# Altium schematic sheet Overo.SchDoc
size A4
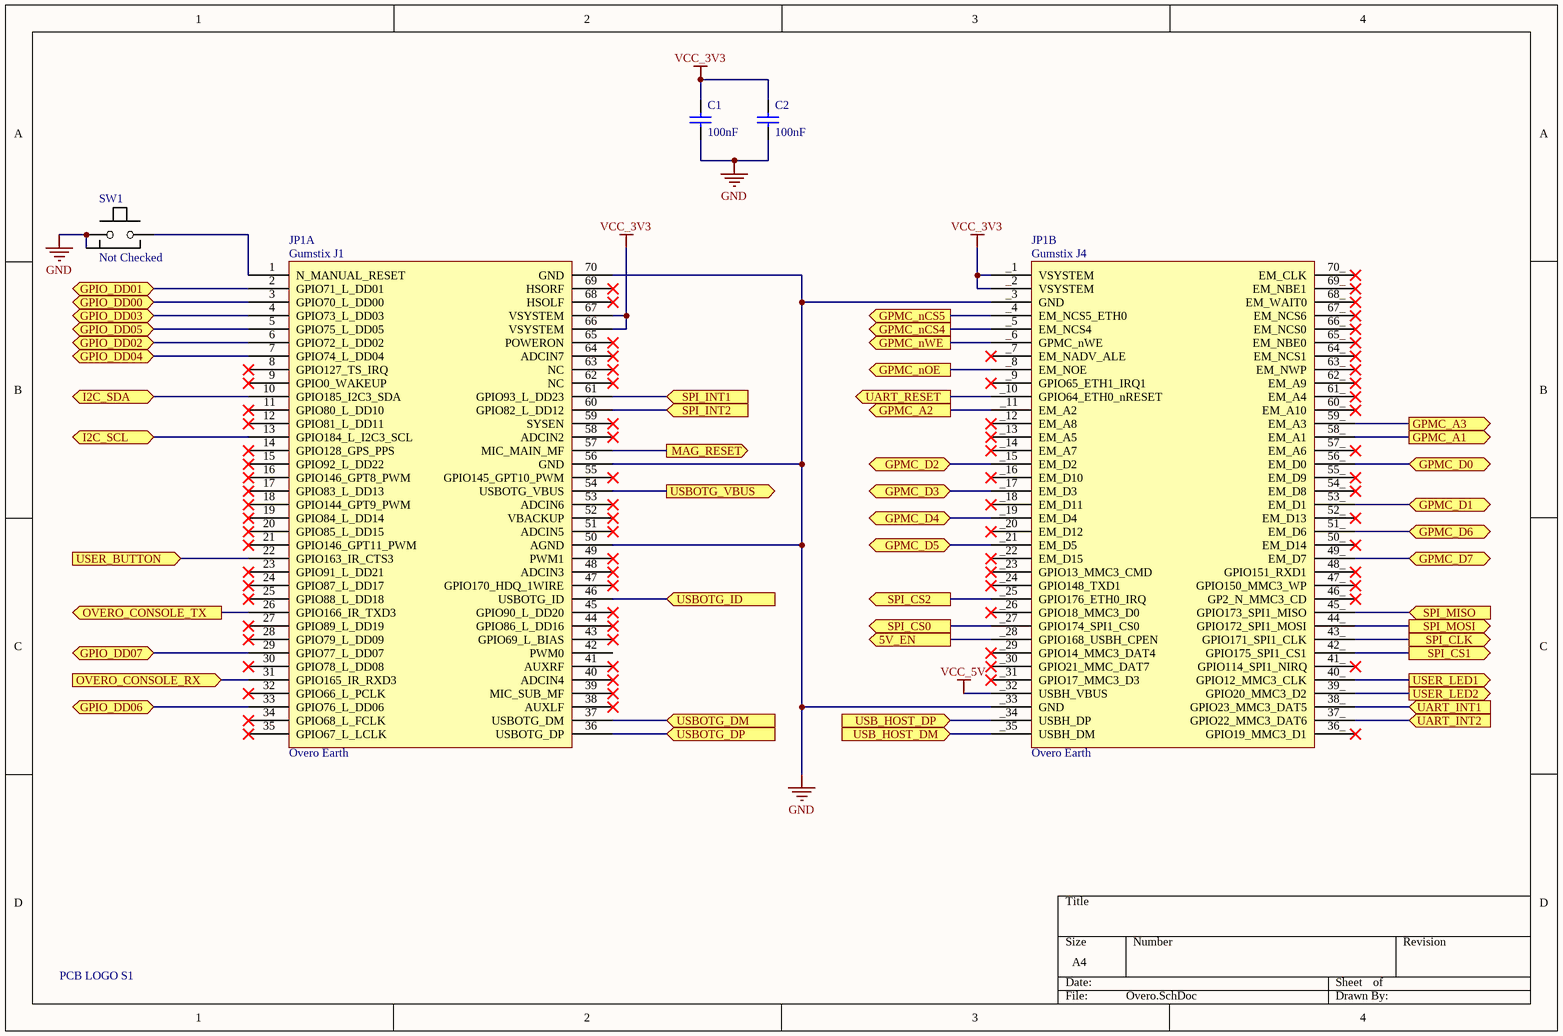
[diagram p0: Overo.SchDoc]

## Parts
C1  100nF  [0603]
C2  100nF  [0603]
JP1  Overo Earth  (parts A,B of 2)
PCB_LOGO_S1  GRC_LOGO_SMALL  [GRC_LOGO_20x10MM]  (value not drawn)
SW1  Verify: Not Checked  [PUSHBUTTON_B3U]  (hidden comment: Push Button Switch)

## Ports
5V_EN (out), GPIO_DD00 (bidir), GPIO_DD01 (bidir), GPIO_DD02 (bidir), GPIO_DD03 (bidir), GPIO_DD04 (bidir), GPIO_DD05 (bidir), GPIO_DD06 (bidir), GPIO_DD07 (bidir), GPMC_A1 (out), GPMC_A2 (out), GPMC_A3 (out), GPMC_D0 (bidir), GPMC_D1 (bidir), GPMC_D2 (bidir), GPMC_D3 (bidir), GPMC_D4 (bidir), GPMC_D5 (bidir), GPMC_D6 (bidir), GPMC_D7 (bidir), GPMC_nCS4 (out), GPMC_nCS5 (out), GPMC_nOE (out), GPMC_nWE (out), I2C_SCL (bidir), I2C_SDA (bidir), MAG_RESET (out), OVERO_CONSOLE_RX (in), OVERO_CONSOLE_TX (out), SPI_CLK (out), SPI_CS0 (out), SPI_CS1 (out), SPI_CS2 (out), SPI_INT1 (in), SPI_INT2 (in), SPI_MISO (in), SPI_MOSI (out), UART_INT1 (in), UART_INT2 (in), UART_RESET (out), USB_HOST_DM (in), USB_HOST_DP (in), USBOTG_DM (in), USBOTG_DP (in), USBOTG_ID (in), USBOTG_VBUS (out), USER_BUTTON (in), USER_LED1 (out), USER_LED2 (out)

## Nets
GND: C1.1 C2.1 JP1.50(AGND) JP1.56(GND) JP1.70(GND) JP1._3(GND) JP1._33(GND) SW1.1 SW1.3(GND)
VCC_3V3: C1.2 C2.2 JP1.66(VSYSTEM) JP1.67(VSYSTEM) JP1._1(VSYSTEM) JP1._2(VSYSTEM)
VCC_5V: JP1._32(USBH_VBUS)
5V_EN: JP1._28(GPIO168_USBH_CPEN) ; port 5V_EN
GPIO_DD00: JP1.3(GPIO70_L_DD00) ; port GPIO_DD00
GPIO_DD01: JP1.2(GPIO71_L_DD01) ; port GPIO_DD01
GPIO_DD02: JP1.6(GPIO72_L_DD02) ; port GPIO_DD02
GPIO_DD03: JP1.4(GPIO73_L_DD03) ; port GPIO_DD03
GPIO_DD04: JP1.7(GPIO74_L_DD04) ; port GPIO_DD04
GPIO_DD05: JP1.5(GPIO75_L_DD05) ; port GPIO_DD05
GPIO_DD06: JP1.33(GPIO76_L_DD06) ; port GPIO_DD06
GPIO_DD07: JP1.29(GPIO77_L_DD07) ; port GPIO_DD07
GPMC_A1: JP1.58_(EM_A1) ; port GPMC_A1
GPMC_A2: JP1._11(EM_A2) ; port GPMC_A2
GPMC_A3: JP1.59_(EM_A3) ; port GPMC_A3
GPMC_D0: JP1.56_(EM_D0) ; port GPMC_D0
GPMC_D1: JP1.53_(EM_D1) ; port GPMC_D1
GPMC_D2: JP1._15(EM_D2) ; port GPMC_D2
GPMC_D3: JP1._17(EM_D3) ; port GPMC_D3
GPMC_D4: JP1._19(EM_D4) ; port GPMC_D4
GPMC_D5: JP1._21(EM_D5) ; port GPMC_D5
GPMC_D6: JP1.51_(EM_D6) ; port GPMC_D6
GPMC_D7: JP1.49_(EM_D7) ; port GPMC_D7
GPMC_nCS4: JP1._5(EM_NCS4) ; port GPMC_nCS4
GPMC_nCS5: JP1._4(EM_NCS5_ETH0) ; port GPMC_nCS5
GPMC_nOE: JP1._8(EM_NOE) ; port GPMC_nOE
GPMC_nWE: JP1._6(GPMC_nWE) ; port GPMC_nWE
I2C_SCL: JP1.13(GPIO184_L_I2C3_SCL) ; port I2C_SCL
I2C_SDA: JP1.10(GPIO185_I2C3_SDA) ; port I2C_SDA
MAG_RESET: JP1.57(MIC_MAIN_MF) ; port MAG_RESET
OVERO_CONSOLE_RX: JP1.31(GPIO165_IR_RXD3) ; port OVERO_CONSOLE_RX
OVERO_CONSOLE_TX: JP1.26(GPIO166_IR_TXD3) ; port OVERO_CONSOLE_TX
SPI_CLK: JP1.43_(GPIO171_SPI1_CLK) ; port SPI_CLK
SPI_CS0: JP1._27(GPIO174_SPI1_CS0) ; port SPI_CS0
SPI_CS1: JP1.42_(GPIO175_SPI1_CS1) ; port SPI_CS1
SPI_CS2: JP1._25(GPIO176_ETH0_IRQ) ; port SPI_CS2
SPI_INT1: JP1.61(GPIO93_L_DD23) ; port SPI_INT1
SPI_INT2: JP1.60(GPIO82_L_DD12) ; port SPI_INT2
SPI_MISO: JP1.45_(GPIO173_SPI1_MISO) ; port SPI_MISO
SPI_MOSI: JP1.44_(GPIO172_SPI1_MOSI) ; port SPI_MOSI
UART_INT1: JP1.38_(GPIO23_MMC3_DAT5) ; port UART_INT1
UART_INT2: JP1.37_(GPIO22_MMC3_DAT6) ; port UART_INT2
UART_RESET: JP1._10(GPIO64_ETH0_nRESET) ; port UART_RESET
USB_HOST_DM: JP1._35(USBH_DM) ; port USB_HOST_DM
USB_HOST_DP: JP1._34(USBH_DP) ; port USB_HOST_DP
USBOTG_DM: JP1.37(USBOTG_DM) ; port USBOTG_DM
USBOTG_DP: JP1.36(USBOTG_DP) ; port USBOTG_DP
USBOTG_ID: JP1.46(USBOTG_ID) ; port USBOTG_ID
USBOTG_VBUS: JP1.54(USBOTG_VBUS) ; port USBOTG_VBUS
USER_BUTTON: JP1.22(GPIO163_IR_CTS3) ; port USER_BUTTON
USER_LED1: JP1.40_(GPIO12_MMC3_CLK) ; port USER_LED1
USER_LED2: JP1.39_(GPIO20_MMC3_D2) ; port USER_LED2
NetJP1_1: JP1.1(N_MANUAL_RESET) SW1.2

Not connected (* = marked no-connect by the designer): JP1 8(GPIO127_TS_IRQ)* 9(GPIO0_WAKEUP)* 11(GPIO80_L_DD10)* 12(GPIO81_L_DD11)* 14(GPIO128_GPS_PPS)* 15(GPIO92_L_DD22)* 16(GPIO146_GPT8_PWM)* 17(GPIO83_L_DD13)* 18(GPIO144_GPT9_PWM)* 19(GPIO84_L_DD14)* 20(GPIO85_L_DD15)* 21(GPIO146_GPT11_PWM)* 23(GPIO91_L_DD21)* 24(GPIO87_L_DD17)* 25(GPIO88_L_DD18)* 27(GPIO89_L_DD19)* 28(GPIO79_L_DD09)* 30(GPIO78_L_DD08)* 32(GPIO66_L_PCLK)* 34(GPIO68_L_FCLK)* 35(GPIO67_L_LCLK)* 36_(GPIO19_MMC3_D1)* 38(AUXLF)* 39(MIC_SUB_MF)* 40(ADCIN4)* 41(AUXRF)* 41_(GPIO114_SPI1_NIRQ)* 42(PWM0) 43(GPIO69_L_BIAS)* 44(GPIO86_L_DD16)* 45(GPIO90_L_DD20)* 46_(GP2_N_MMC3_CD)* 47(GPIO170_HDQ_1WIRE)* 47_(GPIO150_MMC3_WP)* 48(ADCIN3)* 48_(GPIO151_RXD1)* 49(PWM1)* 50_(EM_D14)* 51(ADCIN5)* 52(VBACKUP)* 52_(EM_D13)* 53(ADCIN6)* 54_(EM_D8)* 55(GPIO145_GPT10_PWM)* 55_(EM_D9)* 57_(EM_A6)* 58(ADCIN2)* 59(SYSEN)* 60_(EM_A10)* 61_(EM_A4)* 62(NC)* 62_(EM_A9)* 63(NC)* 63_(EM_NWP)* 64(ADCIN7)* 64_(EM_NCS1)* 65(POWERON)* 65_(EM_NBE0)* 66_(EM_NCS0)* 67_(EM_NCS6)* 68(HSOLF)* 68_(EM_WAIT0)* 69(HSORF)* 69_(EM_NBE1)* 70_(EM_CLK)* _7(EM_NADV_ALE)* _9(GPIO65_ETH1_IRQ1)* _12(EM_A8)* _13(EM_A5)* _14(EM_A7)* _16(EM_D10)* _18(EM_D11)* _20(EM_D12)* _22(EM_D15)* _23(GPIO13_MMC3_CMD)* _24(GPIO148_TXD1)* _26(GPIO18_MMC3_D0)* _29(GPIO14_MMC3_DAT4)* _30(GPIO21_MMC_DAT7)* _31(GPIO17_MMC3_D3)*

## Notes on the sheet
- (in symbol UN_GUMSTIX_OVERO_EARTH, part A) Gumstix J1
- (in symbol UN_GUMSTIX_OVERO_EARTH, part B) Gumstix J4

## Library data of the parts
C1 C2 = CP_100nF 0603: CAP CER .10UF 50V X5R 0603; Manufacturer: Taiyo Yuden; Manufacturer PN: UMK107B7104KA-T; Prototype: Digikey 587-1243-1-ND; LatestRevisionDate: 29 May 08; Value: 100nF
JP1 = UN_GUMSTIX_OVERO_EARTH: Gumstix Overo OMAP35xx Computer Module
PCB_LOGO_S1 = GRC_LOGO_SMALL: GRC Logo 20x10mm; Published: 24-Mar-1999; LatestRevisionDate: 17-Jul-2002; LatestRevisionNote: Re-released for DXP Platform.; PackageReference: SPST-2; Publisher: Altium Limited
SW1 = SW_TACT 3MM RT: SWITCH TACT RT ANG SPST SMD; Manufacturer: Omron; Manufacturer PN: B3U-3100P; Prototype: SW1023CT-ND; LatestRevisionDate: 22 Jun 08; Value: Push Button Switch